# Altium project MB1184.PrjPCB
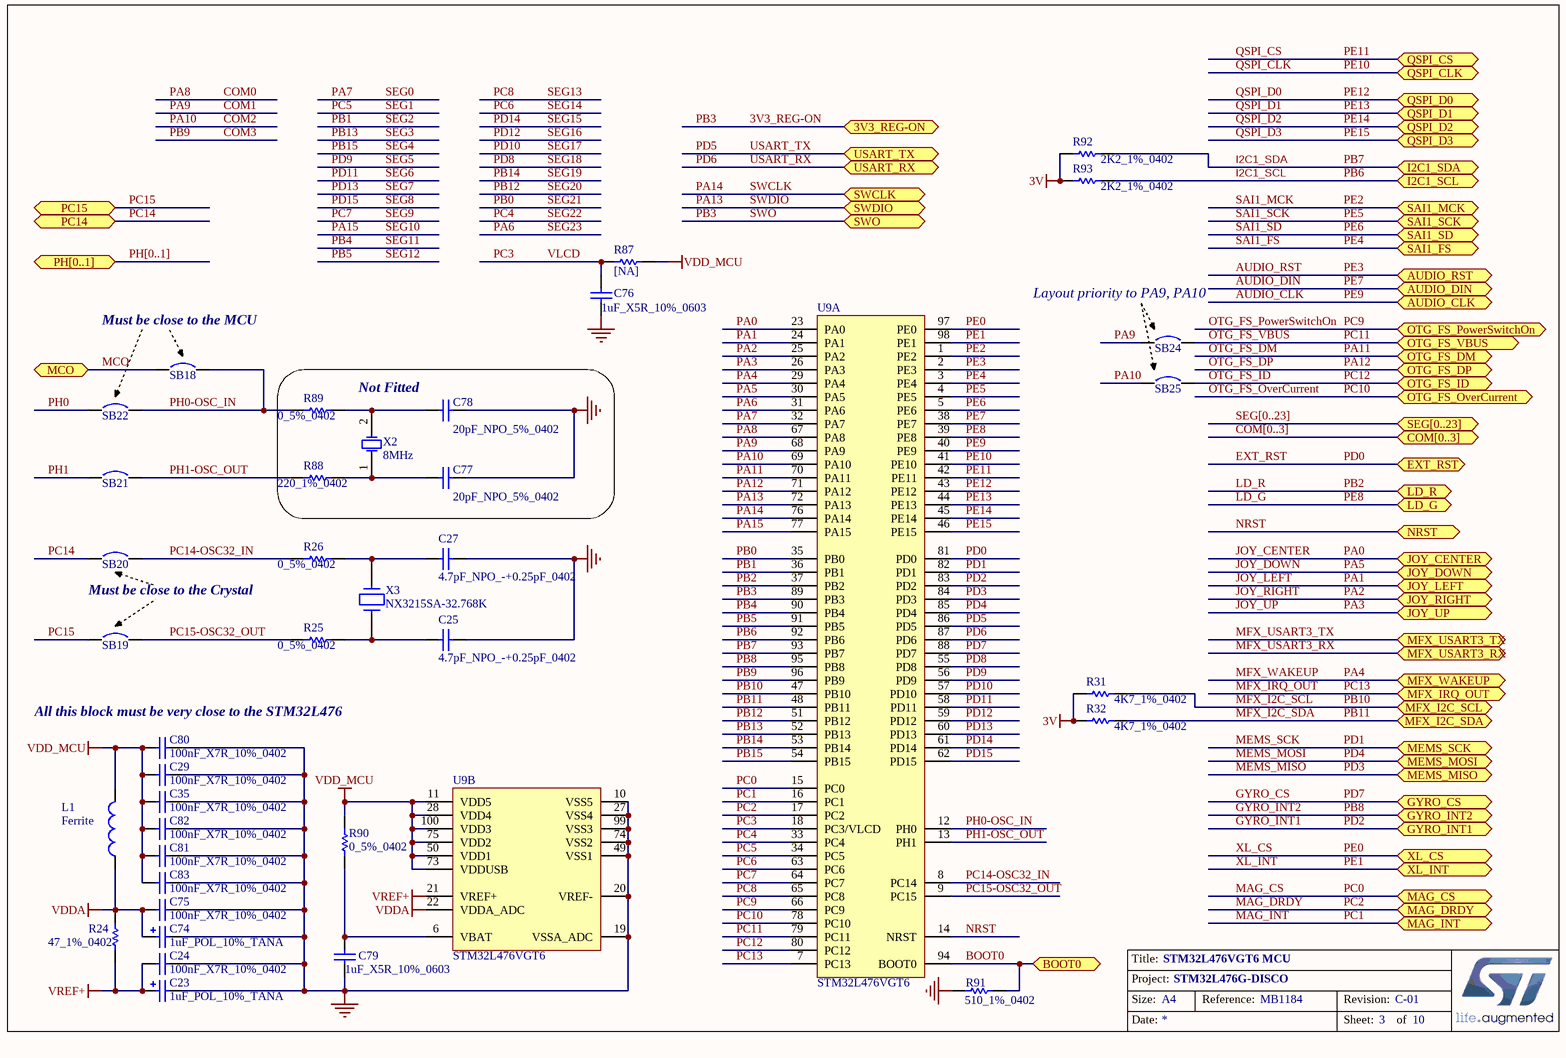
[diagram p0: STM32Lx.SchDoc]
5 sheets, 127 parts. Net scope: flat (ports and power ports of the same name join across sheets).
Sheets:
  STM32Lx.SchDoc
  IDD_measurement.SchDoc
  LCD_GH08172.SchDoc
  AUDIO.SchDoc
  MEMS.SchDoc

## Sheet STM32Lx.SchDoc: STM32L476VGT6 MCU
size A4; Date: 01-DEC-2013; Author: A.B; CompanyName: STMicroelectronics; Organization: Microcontrollers Division; Address1: 12, Rue Jules HOROWITZ; Address2: 38019 Grenoble; Address3: FRANCE; DocumentNumber: MB1184; Revision: C-01; SheetNumber: 3; SheetTotal: 10; Project: STM32L476G-DISCO

### Parts
C23  1uF_POL_10%_TANA  [TAN-A]
C24  100nF_X7R_10%_0402  [0402C]
C25  4.7pF_NPO_-+0.25pF_0402  [0402C]
C27  4.7pF_NPO_-+0.25pF_0402  [0402C]
C29  100nF_X7R_10%_0402  [0402C]
C35  100nF_X7R_10%_0402  [0402C]
C74  1uF_POL_10%_TANA  [TAN-A]
C75  100nF_X7R_10%_0402  [0402C]
C76  1uF_X5R_10%_0603  [0603C]
C77  20pF_NPO_5%_0402  [0402C]
C78  20pF_NPO_5%_0402  [0402C]
C79  1uF_X5R_10%_0603  [0603C]
C80  100nF_X7R_10%_0402  [0402C]
C81  100nF_X7R_10%_0402  [0402C]
C82  100nF_X7R_10%_0402  [0402C]
C83  100nF_X7R_10%_0402  [0402C]
L1  Ferrite  [0603L]
R24  47_1%_0402  [0402R]
R25  0_5%_0402  [0402R]
R26  0_5%_0402  [0402R]
R31  4K7_1%_0402  [0402R]
R32  4K7_1%_0402  [0402R]
R87  [NA]  [0402R]
R88  220_1%_0402  [0402R]
R89  0_5%_0402  [0402R]
R90  0_5%_0402  [0402R]
R91  510_1%_0402  [0402R]
R92  2K2_1%_0402  [0402R]
R93  2K2_1%_0402  [0402R]
SB18  Circuit Breaker  [JP2_SMD]  (value not drawn)
SB19  Circuit Breaker  [JP2_SMD]  (value not drawn)
SB20  Circuit Breaker  [JP2_SMD]  (value not drawn)
SB21  Circuit Breaker  [JP2_SMD]  (value not drawn)
SB22  Circuit Breaker  [JP2_SMD]  (value not drawn)
SB24  Circuit Breaker  [JP2_SMD]  (value not drawn)
SB25  Circuit Breaker  [JP2_SMD]  (value not drawn)
U9  STM32L476VGT6  [TQFP100_14x14]  (parts A,B of 2)
X2  8MHz  [XTAL1]
X3  NX3215SA-32.768K  [XTAL_2SM_3R2X1R5]

### Blocks framed on the sheet
Not Fitted: C77 C78 R88 R89 X2

### Ports
3V3_REG-ON, AUDIO_CLK, AUDIO_DIN, AUDIO_RST, BOOT0, COM[0..3], EXT_RST, GYRO_CS, GYRO_INT1, GYRO_INT2, I2C1_SCL, I2C1_SDA, JOY_CENTER, JOY_DOWN, JOY_LEFT, JOY_RIGHT, JOY_UP, LD_G, LD_R, MAG_CS, MAG_DRDY, MAG_INT, MCO, MEMS_MISO, MEMS_MOSI, MEMS_SCK, MFX_I2C_SCL, MFX_I2C_SDA, MFX_IRQ_OUT, MFX_USART3_RX, MFX_USART3_TX, MFX_WAKEUP, NRST, OTG_FS_DM, OTG_FS_DP, OTG_FS_ID, OTG_FS_OverCurrent, OTG_FS_PowerSwitchOn, OTG_FS_VBUS, PC14, PC15, PH[0..1], QSPI_CLK, QSPI_CS, QSPI_D0, QSPI_D1, QSPI_D2 (bidir), QSPI_D3, SAI1_FS, SAI1_MCK, SAI1_SCK, SAI1_SD, SEG[0..23], SWCLK, SWDIO, SWO, USART_RX, USART_TX, XL_CS, XL_INT

### Nets
3V: R31.1 R32.1 R92.1 R93.1
GND: C23.2 C24.2 C25.2 C27.2 C29.2 C35.2 C74.2 C75.2 C76.1 C77.2 C78.2 C79.1 C80.2 C81.2 C82.2 C83.2 R91.1 U9.10(VSS5) U9.19(VSSA_ADC) U9.20(VREF-) U9.27(VSS4) U9.49(VSS1) U9.74(VSS2) U9.99(VSS3)
VDD_MCU: C29.1 C35.1 C80.1 C81.1 C82.1 C83.1 L1.2 R87.2 R90.2 U9.11(VDD5) U9.28(VDD4) U9.50(VDD1) U9.73(VDDUSB) U9.75(VDD2) U9.100(VDD3)
VDDA: C74.1 C75.1 L1.1 R24.2 U9.22(VDDA_ADC)
VREF+: C23.1 C24.1 R24.1 U9.21(VREF+)
3V3_REG-ON: U9.89(PB3) ; port SWO, port 3V3_REG-ON  [also labelled PB3, SWO]
AUDIO_CLK: U9.40(PE9) ; port AUDIO_CLK  [also labelled PE9]
AUDIO_DIN: U9.38(PE7) ; port AUDIO_DIN  [also labelled PE7]
AUDIO_RST: U9.2(PE3) ; port AUDIO_RST  [also labelled PE3]
BOOT0: R91.2 U9.94(BOOT0) ; port BOOT0
COM0: U9.67(PA8)  [also labelled PA8]
COM1: SB24.1 U9.68(PA9)  [also labelled PA9]
COM2: SB25.1 U9.69(PA10)  [also labelled PA10]
COM3: U9.96(PB9)  [also labelled PB9]
EXT_RST: U9.81(PD0) ; port EXT_RST  [also labelled PD0]
GYRO_CS: U9.88(PD7) ; port GYRO_CS  [also labelled PD7]
GYRO_INT1: U9.83(PD2) ; port GYRO_INT1  [also labelled PD2]
GYRO_INT2: U9.95(PB8) ; port GYRO_INT2  [also labelled PB8]
I2C1_SCL: R93.2 U9.92(PB6) ; port I2C1_SCL  [also labelled PB6]
I2C1_SDA: R92.2 U9.93(PB7) ; port I2C1_SDA  [also labelled PB7]
JOY_CENTER: U9.23(PA0) ; port JOY_CENTER  [also labelled PA0]
JOY_DOWN: U9.30(PA5) ; port JOY_DOWN  [also labelled PA5]
JOY_LEFT: U9.24(PA1) ; port JOY_LEFT  [also labelled PA1]
JOY_RIGHT: U9.25(PA2) ; port JOY_RIGHT  [also labelled PA2]
JOY_UP: U9.26(PA3) ; port JOY_UP  [also labelled PA3]
LD_G: U9.39(PE8) ; port LD_G  [also labelled PE8]
LD_R: U9.37(PB2) ; port LD_R  [also labelled PB2]
MAG_CS: U9.15(PC0) ; port MAG_CS  [also labelled PC0]
MAG_DRDY: U9.17(PC2) ; port MAG_DRDY  [also labelled PC2]
MAG_INT: U9.16(PC1) ; port MAG_INT  [also labelled PC1]
MCO: SB18.1 ; port MCO
MEMS_MISO: U9.84(PD3) ; port MEMS_MISO  [also labelled PD3]
MEMS_MOSI: U9.85(PD4) ; port MEMS_MOSI  [also labelled PD4]
MEMS_SCK: U9.82(PD1) ; port MEMS_SCK  [also labelled PD1]
MFX_I2C_SCL: R31.2 U9.47(PB10) ; port MFX_I2C_SCL  [also labelled PB10]
MFX_I2C_SDA: R32.2 U9.48(PB11) ; port MFX_I2C_SDA  [also labelled PB11]
MFX_IRQ_OUT: U9.7(PC13) ; port MFX_IRQ_OUT  [also labelled PC13]
MFX_WAKEUP: U9.29(PA4) ; port MFX_WAKEUP  [also labelled PA4]
NRST: U9.14(NRST) ; port NRST
OTG_FS_DM: U9.70(PA11) ; port OTG_FS_DM  [also labelled PA11]
OTG_FS_DP: U9.71(PA12) ; port OTG_FS_DP  [also labelled PA12]
OTG_FS_ID: SB25.2 U9.80(PC12) ; port OTG_FS_ID  [also labelled PC12]
OTG_FS_OverCurrent: U9.78(PC10) ; port OTG_FS_OverCurrent  [also labelled PC10]
OTG_FS_PowerSwitchOn: U9.66(PC9) ; port OTG_FS_PowerSwitchOn  [also labelled PC9]
OTG_FS_VBUS: SB24.2 U9.79(PC11) ; port OTG_FS_VBUS  [also labelled PC11]
PA6: U9.31(PA6)  [also labelled SEG23]
PA7: U9.32(PA7)  [also labelled SEG0]
PA13: U9.72(PA13) ; port SWDIO  [also labelled SWDIO]
PA14: U9.76(PA14) ; port SWCLK  [also labelled SWCLK]
PA15: U9.77(PA15)  [also labelled SEG10]
PB0: U9.35(PB0)  [also labelled SEG21]
PB1: U9.36(PB1)  [also labelled SEG2]
PB4: U9.90(PB4)  [also labelled SEG11]
PB5: U9.91(PB5)  [also labelled SEG12]
PB12: U9.51(PB12)  [also labelled SEG20]
PB13: U9.52(PB13)  [also labelled SEG3]
PB14: U9.53(PB14)  [also labelled SEG19]
PB15: U9.54(PB15)  [also labelled SEG4]
PC3: C76.2 R87.1 U9.18(PC3/VLCD)  [also labelled VLCD]
PC4: U9.33(PC4)  [also labelled SEG22]
PC5: U9.34(PC5)  [also labelled SEG1]
PC6: U9.63(PC6)  [also labelled SEG14]
PC7: U9.64(PC7)  [also labelled SEG9]
PC8: U9.65(PC8)  [also labelled SEG13]
PC14: SB20.1 ; port PC14
PC14-OSC32_IN: R26.1 SB20.2 U9.8(PC14)
PC15: SB19.1 ; port PC15
PC15-OSC32_OUT: R25.1 SB19.2 U9.9(PC15)
PD5: U9.86(PD5) ; port USART_TX  [also labelled USART_TX]
PD6: U9.87(PD6) ; port USART_RX  [also labelled USART_RX]
PD8: U9.55(PD8)  [also labelled SEG18]
PD9: U9.56(PD9)  [also labelled SEG5]
PD10: U9.57(PD10)  [also labelled SEG17]
PD11: U9.58(PD11)  [also labelled SEG6]
PD12: U9.59(PD12)  [also labelled SEG16]
PD13: U9.60(PD13)  [also labelled SEG7]
PD14: U9.61(PD14)  [also labelled SEG15]
PD15: U9.62(PD15)  [also labelled SEG8]
PE0: U9.97(PE0) ; port XL_CS  [also labelled XL_CS]
PE1: U9.98(PE1) ; port XL_INT  [also labelled XL_INT]
PE2: U9.1(PE2) ; port SAI1_MCK  [also labelled SAI1_MCK]
PE4: U9.3(PE4) ; port SAI1_FS  [also labelled SAI1_FS]
PE5: U9.4(PE5) ; port SAI1_SCK  [also labelled SAI1_SCK]
PE6: U9.5(PE6) ; port SAI1_SD  [also labelled SAI1_SD]
PE10: U9.41(PE10) ; port QSPI_CLK  [also labelled QSPI_CLK]
PE11: U9.42(PE11) ; port QSPI_CS  [also labelled QSPI_CS]
PE12: U9.43(PE12) ; port QSPI_D0  [also labelled QSPI_D0]
PE13: U9.44(PE13) ; port QSPI_D1  [also labelled QSPI_D1]
PE14: U9.45(PE14) ; port QSPI_D2  [also labelled QSPI_D2]
PE15: U9.46(PE15) ; port QSPI_D3  [also labelled QSPI_D3]
PH0: SB22.1
PH0-OSC_IN: R89.1 SB18.2 SB22.2 U9.12(PH0)
PH1: SB21.1
PH1-OSC_OUT: R88.1 SB21.2 U9.13(PH1)
NetC25_1: C25.1 R25.2 X3.2
NetC27_1: C27.1 R26.2 X3.1
NetC77_1: C77.1 R88.2 X2.1(OSC1)
NetC78_1: C78.1 R89.2 X2.2(OSC2)
NetC79_2: C79.2 R90.1 U9.6(VBAT)

### Buses and harness runs
bus COM[0..3] = port COM[0..3]
bus PH[0..1] = port PH[0..1]
bus SEG[0..23] = port SEG[0..23]

### Notes on the sheet
- (near SB24) Layout priority to PA9, PA10
- (near SB18) Must be close to the MCU
- Must be close to the Crystal
- (near C80) All this block must be very close to the STM32L476
- Title:
- Project:
- Size:
- Date:
- A4
- Reference:
- Sheet:
- Revision:
- of

### Library data of the parts
C23 C74 = Cap_1uF_POL_10%_TANA: Polarized Capacitor,1uF,16V,10%,typeA,AVX; Manuf_Part_1: TAJA105K016R; Revision: July-2002: Re-released for DXP Platform.; Value: 1uF; Manuf_1: AVX; Distrib: *; Order: TAJA105K016R; ECCN_US/EU: n/a
C24 C29 C35 C75 C80-C83 = Cap_100nF_X7R_10%_0402: Capacitor,100nF,16V,X7R,10%,0402,YAGEO; Manuf_Part_1: CC0402KRX7R7BB104; Revision: July-2002: Re-released for DXP Platform.; Value: 100nF; Order: CC0402KRX7R7BB104; Manuf_1: YAGEO; ECCN_US/EU: n/a
C25 C27 = Cap_4.7pF_NPO_-+0.25pF_0402: Capacitor, 4.7pF, 50V, NPO, -+0.25pF, 0402, YAGEO; Manuf_Part_1: CC0402CRNPO9BN4R7; Order: 311-1367-2-ND; Revision: July-2002: Re-released for DXP Platform.; Value: 4.7pF; Manuf_1: YAGEO; ECCN_US/EU: n/a; Distrib: DIGIKEY
C76 C79 = Cap_1uF_X5R_10%_0603: Capacitor,1uF,16V,X5R,10%,0603,YAGEO; Manuf_Part_1: CC0603KRX5R7BB105; Revision: July-2002: Re-released for DXP Platform.; Value: 1uF; Order: CC0603KRX5R7BB105; Manuf_1: YAGEO; ECCN_US/EU: n/a
C77 C78 = Cap_20pF_NPO_5%_0402: Capacitor,20pF,50V,NPO,5%,0402,YAGEO; Order: CC0402JRNPO9BN200; Fitted: NO; Revision: July-2002: Re-released for DXP Platform.; Value: 20pF; Manuf_1: YAGEO; Manuf_Part_1: CC0402JRNPO9BN200; ECCN_US/EU: n/a
L1 = BEAD_600R_350MA_0603: Bead,600R,350mA,0603,FCM1608KF-601T03,Tai-tech; Manuf_2: TDK; Manuf_Part_2: MPZ1608S300A; Value: 100uH; Comment_1: bead,30R,5A,0603,MPZ1608S300A,TDK; Revision: July-2002: Re-released for DXP Platform.; Manuf_Part_1: FCM1608KF-601T03; Order: FCM1608KF-601T03; Manuf_1: Tai-tech; ECCN_US/EU: n/a
R24 = Res_47_1%_0402: Resistor,47,0402,1%,YAGEO; Manuf_Part_1: RC0402FR-0747RL; Value: 47; Order: 311-47.0LRCT-ND; Manuf_1: YAGEO; ECCN_US/EU: n/a; Distrib: DIGIKEY
R25 R26 R90 = Res_0_5%_0402: Resistor,0,0402,5%,YAGEO; Manuf_Part_1: RC0402JR-070RL; Value: 0; Order: 2363467; ECCN_US/EU: n/a; Manuf_1: YAGEO; Distrib: FARNELL
R31 R32 = Res_4K7_1%_0402: Resistor,4K7,0402,1%,YAGEO; Manuf_Part_1: RT0402FRE074K7L; Value: 4K7; Manuf_1: YAGEO; Order: RT0402FRE074K7L; ECCN_US/EU: n/a
R87 = Res_NA_0402: Resistor,[NA],0402; Fitted: NO; Value: [NA]; ECCN_US/EU: n/a
R88 = Res_220_1%_0402: Resistor,220,0402,1%,YAGEO; Manuf_Part_1: RC0402FR-07220RL; Value: 220; Fitted: NO; Manuf_1: YAGEO; Order: RC0402FR-07220RL; ECCN_US/EU: n/a; Distrib: DIGIKEY
R89 = Res_0_5%_0402: Resistor,0,0402,5%,YAGEO; Manuf_Part_1: RC0402JR-070RL; Value: 0; Order: 2363467; Fitted: NO; ECCN_US/EU: n/a; Manuf_1: YAGEO; Distrib: FARNELL
R91 = Res_510_1%_0402: Resistor,510,0402,1%,YAGEO; Manuf_Part_1: RC0402FR-07510L; Value: 510; Manuf_1: YAGEO; Order: RC0402FR-07510L; ECCN_US/EU: n/a; Distrib: DIGIKEY
R92 R93 = Res_2K2_1%_0402: Resistor,2K2,0402,1%,YAGEO; Manuf_Part_1: RC0402FR-072R2L; Value: 2K2; Manuf_1: YAGEO; Order: RC0402FR-072R2L; ECCN_US/EU: n/a
SB18-SB20 SB24 SB25 = Circuit Breaker: Solder: NO; Published: 24-Mar-1999; Revision: July-2002: Re-released for DXP Platform.; Publisher: Altium Limited
SB21 SB22 = Circuit Breaker: Solder: YES; Published: 24-Mar-1999; Revision: July-2002: Re-released for DXP Platform.; Publisher: Altium Limited
U9 = STM32L476VGT6: STM32 Orca (STM32L476VGT6); Manuf_Part_1: STM32L476VGT6U; Manuf_1: STM; Provided: ST; Ref St: xxxxxxxxx; ECCN_US/EU: 3A991A2/NEC; Distrib: ST; Footprint: QFP100
X2 = XTAL: Crystal Oscillator,8Mhz,20PF,20PPM,-10-70 degree,DIP,HC-49S; Manuf_Part_1: 9SL8000020AFXHF0; ECCN_US/EU: EAR99/NEC; Fitted: NO; Order: 9SL8000020AFXHF0
X3 = XTAL_32K_NX3215SA: Crystal 32.768kHz, 6pF, -+20PPM, R=50K, SMD; Manuf_1: NDK; Manuf_Part_1: NX3215SA 32.768KHz EXS00A-MU00525; ECCN_US/EU: EAR99/NEC; Ref St: 9157034; NDK Ref: X3101802; Provided: ST; Distrib: *; Order: NX3215SA 32.768KHz EXS00A-MU00525

## Sheet IDD_measurement.SchDoc: IDD measurement / MFX (Multi Function eXpander)
size A4; Date: 01-DEC-2013; Author: A.B; CompanyName: STMicroelectronics; Organization: Microcontrollers Division; Address1: 12, Rue Jules HOROWITZ; Address2: 38019 Grenoble; Address3: FRANCE; DocumentNumber: MB1184; Revision: C-01; SheetNumber: 4; SheetTotal: 10; Project: STM32L476G-DISCO
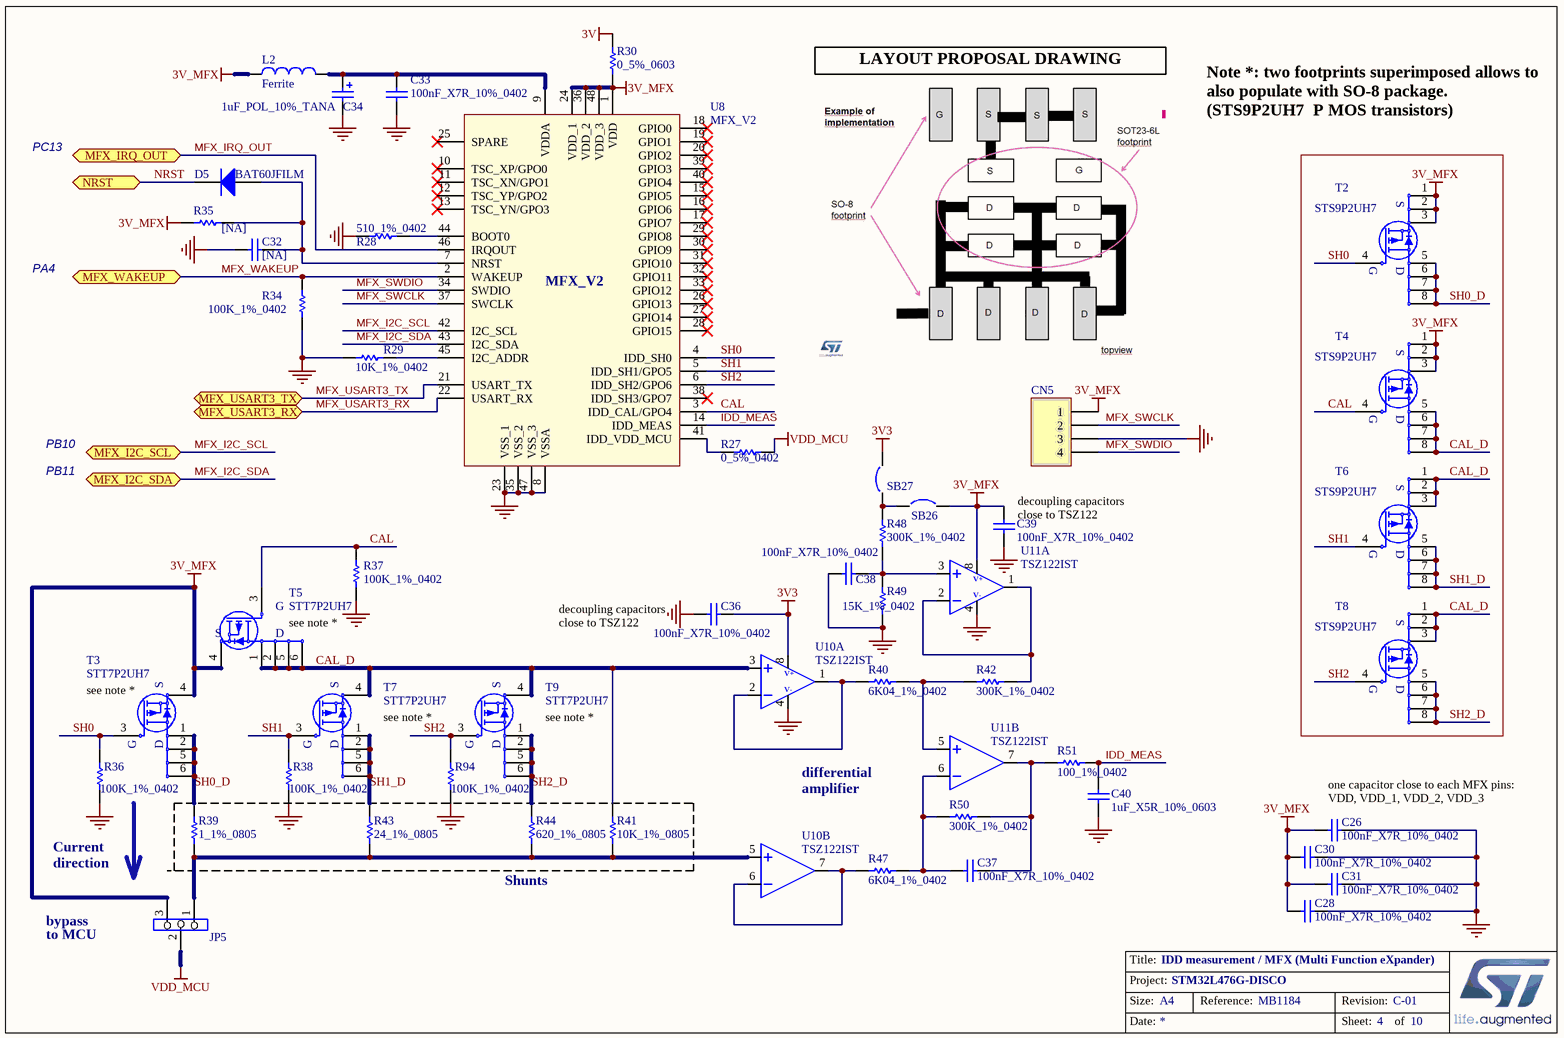
[diagram p1: IDD_measurement.SchDoc]

### Parts
C26  100nF_X7R_10%_0402  [0402C]
C28  100nF_X7R_10%_0402  [0402C]
C30  100nF_X7R_10%_0402  [0402C]
C31  100nF_X7R_10%_0402  [0402C]
C32  [NA]  [0402C]
C33  100nF_X7R_10%_0402  [0402C]
C34  1uF_POL_10%_TANA  [TAN-A]
C36  100nF_X7R_10%_0402  [0402C]
C37  100nF_X7R_10%_0402  [0402C]
C38  100nF_X7R_10%_0402  [0402C]
C39  100nF_X7R_10%_0402  [0402C]
C40  1uF_X5R_10%_0603  [0603C]
CN5  Header 4  [Header 4]  (value not drawn)
D5  BAT60JFILM  [SOD323/A]
JP5  Jumper 3 pins  [SIP3]  (value not drawn)
L2  Ferrite  [0603L]
R27  0_5%_0402  [0402R]
R28  510_1%_0402  [0402R]
R29  10K_1%_0402  [0402R]
R30  0_5%_0603  [0603R-GS]
R34  100K_1%_0402  [0402R]
R35  [NA]  [0402R]
R36  100K_1%_0402  [0402R]
R37  100K_1%_0402  [0402R]
R38  100K_1%_0402  [0402R]
R39  1_1%_0805  [0805R]
R40  6K04_1%_0402  [0402R]
R41  10K_1%_0805  [0805R]
R42  300K_1%_0402  [0402R]
R43  24_1%_0805  [0805R]
R44  620_1%_0805  [0805R]
R47  6K04_1%_0402  [0402R]
R48  300K_1%_0402  [0402R]
R49  15K_1%_0402  [0402R]
R50  300K_1%_0402  [0402R]
R51  100_1%_0402  [0402R]
R94  100K_1%_0402  [0402R]
SB26  Circuit Breaker  [JP2_SMD]  (value not drawn)
SB27  Circuit Breaker  [JP2_SMD]  (value not drawn)
T2  STS9P2UH7  [SO8]
T3  STT7P2UH7  [SOT23-6L]
T4  STS9P2UH7  [SO8]
T5  STT7P2UH7  [SOT23-6L]
T6  STS9P2UH7  [SO8]
T7  STT7P2UH7  [SOT23-6L]
T8  STS9P2UH7  [SO8]
T9  STT7P2UH7  [SOT23-6L]
U8  MFX_V2  [QFP48 7X7]
U10  TSZ122IST  [miniSO8]  (parts A,B of 2)
U11  TSZ122IST  [miniSO8]  (parts A,B of 2)

### Ports
MFX_I2C_SCL, MFX_I2C_SDA, MFX_IRQ_OUT, MFX_USART3_RX, MFX_USART3_TX, MFX_WAKEUP, NRST

### Nets
3V: R30.2
3V3: C36.2 SB27.2 U10.8
3V_MFX: C26.1 C28.1 C30.1 C31.1 C39.2 CN5.1 JP5.3 L2.1 R30.1 R35.1 SB26.2 T2.1(S) T2.2(S) T2.3(S) T3.4(S) T4.1(S) T4.2(S) T4.3(S) T5.4(S) U8.1(VDD) U8.24(VDD_1) U8.36(VDD_2) U8.48(VDD_3) U11.8
GND: C26.2 C28.2 C30.2 C31.2 C32.1 C33.1 C34.2 C36.1 C38.1 C39.1 C40.1 CN5.3 R28.1 R29.1 R34.1 R36.1 R37.1 R38.1 R49.1 R94.1 U8.8(VSSA) U8.23(VSS_1) U8.35(VSS_2) U8.47(VSS_3) U10.4 U11.4
VDD_MCU: JP5.2 R27.2
CAL: R37.2 T4.4(G) T5.3(G) U8.3(IDD_CAL/GPO4)
CAL_D: R41.2 T4.5(D) T4.6(D) T4.7(D) T4.8(D) T5.1(S) T5.2(S) T5.5(D) T5.6(D) T6.1(S) T6.2(S) T6.3(S) T7.4(S) T8.1(S) T8.2(S) T8.3(S) T9.4(S) U10.3
IDD_MEAS: C40.2 R51.2 U8.14(IDD_MEAS)
MFX_I2C_SCL: U8.42(I2C_SCL) ; port MFX_I2C_SCL
MFX_I2C_SDA: U8.43(I2C_SDA) ; port MFX_I2C_SDA
MFX_IRQ_OUT: U8.46(IRQOUT) ; port MFX_IRQ_OUT
MFX_SWCLK: CN5.2 U8.37(SWCLK)
MFX_SWDIO: CN5.4 U8.34(SWDIO)
MFX_USART3_RX: U8.22(USART_RX) ; port MFX_USART3_RX
MFX_USART3_TX: U8.21(USART_TX) ; port MFX_USART3_TX
MFX_WAKEUP: R34.2 U8.2(WAKEUP) ; port MFX_WAKEUP
NRST: D5.2(K) ; port NRST
SH0: R36.2 T2.4(G) T3.3(G) U8.4(IDD_SH0)
SH0_D: R39.2 T2.5(D) T2.6(D) T2.7(D) T2.8(D) T3.1(S) T3.2(S) T3.5(D) T3.6(D)
SH1: R38.2 T6.4(G) T7.3(G) U8.5(IDD_SH1/GPO5)
SH1_D: R43.2 T6.5(D) T6.6(D) T6.7(D) T6.8(D) T7.1(S) T7.2(S) T7.5(D) T7.6(D)
SH2: R94.2 T8.4(G) T9.3(G) U8.6(IDD_SH2/GPO6)
SH2_D: R44.2 T8.5(D) T8.6(D) T8.7(D) T8.8(D) T9.1(S) T9.2(S) T9.5(D) T9.6(D)
NetC32_2: C32.2 D5.1(A) R35.2 U8.7(NRST)
NetC33_2: C33.2 C34.1 L2.2 U8.9(VDDA)
NetC37_1: C37.1 R47.2 R50.1 U11.6
NetC37_2: C37.2 R50.2 R51.1 U11.7
NetC38_2: C38.2 R48.1 R49.2 U11.3
NetJP5_1: JP5.1 R39.1 R41.1 R43.1 R44.1 U10.5
NetR27_1: R27.1 U8.41(IDD_VDD_MCU)
NetR28_2: R28.2 U8.44(BOOT0)
NetR29_2: R29.2 U8.45(I2C_ADDR)
NetR40_1: R40.1 U10.1 U10.2
NetR40_2: R40.2 R42.1 U11.5
NetR42_2: R42.2 U11.1 U11.2
NetR47_1: R47.1 U10.6 U10.7
NetR48_2: R48.2 SB26.1 SB27.1

Not connected (* = marked no-connect by the designer): U8 10(TSC_XP/GPO0)* 11(TSC_XN/GPO1)* 12(TSC_YP/GPO2)* 13(TSC_YN/GPO3)* 15(GPIO5)* 16(GPIO6)* 17(GPIO7)* 18(GPIO0)* 19(GPIO1)* 20(GPIO2)* 25(SPARE)* 26(GPIO13)* 27(GPIO14)* 28(GPIO15)* 29(GPIO8)* 30(GPIO9)* 31(GPIO10)* 32(GPIO11)* 33(GPIO12)* 38(IDD_SH3/GPO7)* 39(GPIO3)* 40(GPIO4)*

### Notes on the sheet
- LAYOUT PROPOSAL DRAWING
- PC13
- Note *: two footprints superimposed allows to also populate with SO-8 package.
  (STS9P2UH7  P MOS transistors)
- PA4
- PB10
- PB11
- (near C39) decoupling capacitors
  close to TSZ122
- (near T5) see note *
- (near C36) decoupling capacitors
  close to TSZ122
- (near T3) see note *
- see note *
- (near T9) see note *
- differential
  amplifier
- (near C26) one capacitor close to each MFX pins: VDD, VDD_1, VDD_2, VDD_3
- Current direction
- Shunts
- to MCU
- bypass
- Title:
- Project:
- Size:
- Date:
- A4
- Reference:
- Sheet:
- Revision:
- of
- (in symbol TSZ122IST, part A) V+; V-

### Library data of the parts
C26 C28 C30 C31 C33 C36-C39 = Cap_100nF_X7R_10%_0402: as C24 on sheet STM32Lx; Revision: July-2002: Re-released for DXP Platform.; Value: 100nF; Order: CC0402KRX7R7BB104; Manuf_1: YAGEO; ECCN_US/EU: n/a
C32 = Cap_NA_0402: Capacitor,NA,0402; Fitted: NO; Revision: July-2002: Re-released for DXP Platform.; Value: [NA]; ECCN_US/EU: n/a
C34 = Cap_1uF_POL_10%_TANA: as C23 on sheet STM32Lx; Revision: July-2002: Re-released for DXP Platform.; Value: 1uF; Manuf_1: AVX; Distrib: *; Order: TAJA105K016R; ECCN_US/EU: n/a
C40 = Cap_1uF_X5R_10%_0603: as C76 on sheet STM32Lx; Revision: July-2002: Re-released for DXP Platform.; Value: 1uF; Order: CC0603KRX5R7BB105; Manuf_1: YAGEO; ECCN_US/EU: n/a
CN5 = Header 4: Header, 4-Pin; Fitted: NO; Revision: 17-Jul-2002: Re-released for DXP Platform.; Publisher: Altium Limited; ECCN_US/EU: n/a
D5 = BAT60JFILM: Manuf_1: STM; Provided: ST; ECCN_US/EU: EAR99/NEC; Ref St: 9151097; Revision: July-2002: Re-released for DXP Platform.; Order: BAT60JFILM; Manuf_Part_1: BAT60JFILM; Distrib: ST
JP5 = Jumper3: ECCN_US/EU: n/a
L2 = BEAD_600R_350MA_0603: Bead,600R,350mA,0603,FCM1608KF-601T03,Tai-tech; Manuf_2: TDK; Manuf_Part_2: MPZ1608S300A; Value: 100uH; Comment_1: bead,30R,5A,0603,MPZ1608S300A,TDK; Ordered by: Subcon; Revision: July-2002: Re-released for DXP Platform.; Manuf_Part_1: FCM1608KF-601T03; Order: FCM1608KF-601T03; Manuf_1: Tai-tech
R27 = Res_0_5%_0402: as R25 on sheet STM32Lx; ECCN_US/EU: n/a; Manuf_1: YAGEO; Distrib: FARNELL
R28 = Res_510_1%_0402: as R91 on sheet STM32Lx; Manuf_1: YAGEO; Order: RC0402FR-07510L; ECCN_US/EU: n/a; Distrib: DIGIKEY
R29 = Res_10K_1%_0402: Resistor,10K,0402,1%,YAGEO; Manuf_Part_1: RC0402FR-0710KL; Value: 10K; Manuf_1: YAGEO; Order: RC0402FR-0710KL; ECCN_US/EU: n/a
R30 = Res_0_5%_0603: Resistor,0,0603,5%,YAGEO; Manuf_Part_1: RC0603JR-070RL; Value: 0; Order: 2363481; ECCN_US/EU: n/a; Manuf_1: YAGEO; Distrib: FARNELL
R34 R36-R38 R94 = Res_100K_1%_0402: Resistor,100K,0402,1%,YAGEO; Manuf_Part_1: RT0402FRE07100KL; Value: 100K; Manuf_1: YAGEO; Order: RT0402FRE07100KL; ECCN_US/EU: n/a
R35 = Res_NA_0402: Resistor,[NA],0402; Fitted: NO; Value: [NA]; ECCN_US/EU: n/a
R39 = Res_1_1%_0805: Resistor,1,0805,1%,YAGEO; Manuf_Part_1: RC0805FR-071RL; Value: 1; Manuf_1: YAGEO; Order: RC0805FR-071RL; ECCN_US/EU: n/a
R40 R47 = Res_6K04_1%_0402: Resistor,6K04,0402,1%,YAGEO; Manuf_Part_1: RC0402FR-076K04L; Value: 6K04; Manuf_1: YAGEO; Order: RC0402FR-076K04L; ECCN_US/EU: n/a
R41 = Res_10K_1%_0805: Resistor,10K,0805,1%,YAGEO; Manuf_Part_1: RC0805FR-0710KL; Value: 10K; Manuf_1: YAGEO; Order: RC0805FR-0710KL; ECCN_US/EU: n/a
R42 R48 R50 = Res_300K_1%_0402: Resistor,300K,0402,1%,YAGEO; Manuf_Part_1: RC0402FR-07300KL; Value: 300K; Manuf_1: YAGEO; Order: RC0402FR-07300KL; ECCN_US/EU: n/a
R43 = Res_24_1%_0805: Resistor,24,0805,1%,YAGEO; Manuf_Part_1: RC0805FR-0724RL; Value: 24; Manuf_1: YAGEO; Order: RC0805FR-0724RL; ECCN_US/EU: n/a
R44 = Res_620_1%_0805: Resistor,620,0805,1%,YAGEO; Manuf_Part_1: RC0805FR-07620RL; Value: 620; Manuf_1: YAGEO; Order: RC0805FR-07620RL; ECCN_US/EU: n/a
R49 = Res_15K_1%_0402: Resistor,15K,0402,1%,YAGEO; Manuf_Part_1: RC0402FR-0715KL; Value: 15K; Manuf_1: YAGEO; Order: RC0402FR-0715KL; ECCN_US/EU: n/a
R51 = Res_100_1%_0402: Resistor,100,0402,1%,YAGEO; Manuf_Part_1: RC0402FR-07100RL; Value: 100; Order: 9239111; Manuf_1: YAGEO; ECCN_US/EU: n/a; Distrib: FARNELL
SB26 = Circuit Breaker: Solder: YES; Revision: July-2002: Re-released for DXP Platform.
SB27 = Circuit Breaker: Solder: NO; Revision: July-2002: Re-released for DXP Platform.
T2 = STS7P2UH7: STripFET VII Power MOSFET, P-CHANNEL 20V - 0.023 - 7A - SO-8; Manuf_1: STM; Provided: ST; Ref St: xxxxxxxx; ECCN_US/EU: EAR99/NEC; Fitted: NO; Comments: exclusive with T9; Manuf_Part_1: STS9P2UH7; Order: STS9P2UH7; Distrib: ST; Ordered by: STM
T3 = STT7P2UH7: STripFET VII DeepGATE Power MOSFET, P-CHANNEL 20 V, 0.0146, 7 A - SOT23-6L; Manuf_1: STM; Provided: ST; Ref St: xxxxxxxx; ECCN_US/EU: EAR99/NEC; Comments: exclusive with T8; Manuf_Part_1: STT7P2UH7; Order: STT7P2UH7; Distrib: ST; Ordered by: STM
T4 = STS7P2UH7: STripFET VII Power MOSFET, P-CHANNEL 20V - 0.023 - 7A - SO-8; Manuf_1: STM; Provided: ST; Ref St: xxxxxxxx; ECCN_US/EU: EAR99/NEC; Fitted: NO; Comments: exclusive with T5; Manuf_Part_1: STS9P2UH7; Order: STS9P2UH7; Distrib: ST; Ordered by: STM
T5 = STT7P2UH7: STripFET VII DeepGATE Power MOSFET, P-CHANNEL 20 V, 0.0146, 7 A - SOT23-6L; Manuf_1: STM; Provided: ST; Ref St: xxxxxxxx; ECCN_US/EU: EAR99/NEC; Comments: exclusive with T2; Manuf_Part_1: STT7P2UH7; Order: STT7P2UH7; Distrib: ST; Ordered by: STM
T6 = STS7P2UH7: STripFET VII Power MOSFET, P-CHANNEL 20V - 0.023 - 7A - SO-8; Manuf_1: STM; Provided: ST; Ref St: xxxxxxxx; ECCN_US/EU: EAR99/NEC; Fitted: NO; Comments: exclusive with T6; Manuf_Part_1: STS9P2UH7; Order: STS9P2UH7; Distrib: ST; Ordered by: STM
T7 = STT7P2UH7: STripFET VII DeepGATE Power MOSFET, P-CHANNEL 20 V, 0.0146, 7 A - SOT23-6L; Manuf_1: STM; Provided: ST; Ref St: xxxxxxxx; ECCN_US/EU: EAR99/NEC; Comments: exclusive with T3; Manuf_Part_1: STT7P2UH7; Order: STT7P2UH7; Distrib: ST; Ordered by: STM
T8 = STS7P2UH7: STripFET VII Power MOSFET, P-CHANNEL 20V - 0.023 - 7A - SO-8; Manuf_1: STM; Provided: ST; Ref St: xxxxxxxx; ECCN_US/EU: EAR99/NEC; Fitted: NO; Comments: exclusive with T7; Manuf_Part_1: STS9P2UH7; Order: STS9P2UH7; Distrib: ST; Ordered by: STM
T9 = STT7P2UH7: STripFET VII DeepGATE Power MOSFET, P-CHANNEL 20 V, 0.0146, 7 A - SOT23-6L; Manuf_1: STM; Provided: ST; Ref St: xxxxxxxx; ECCN_US/EU: EAR99/NEC; Comments: exclusive with T4; Manuf_Part_1: STT7P2UH7; Order: STT7P2UH7; Distrib: ST; Ordered by: STM
U8 = MFX_V2: MultiFunction eXpander (STM32L152CCT6); Manuf_1: STM; ECCN_US/EU: 3A991A2/NEC; Provided: ST; Order: STM32L152CCT6; Distrib: ST; Manuf_Part_1: STM32L152CCT6
U10 U11 = TSZ122IST: Very high accuracy (5 µV) zero drift 5 V dual OpAmp; Manuf_1: STM; ECCN_US/EU: EAR99/NEC; Provided: ST; Ref St: xxxxxxxxx; Manuf_Part_1: TSZ122IST; Distrib: ST; Order: TSZ122IST

## Sheet LCD_GH08172.SchDoc: LCD Display
size A4; Date: 01-DEC-2013; Author: A.B; CompanyName: STMicroelectronics; Organization: Microcontrollers Division; Address1: 12, Rue Jules HOROWITZ; Address2: 38019 Grenoble; Address3: FRANCE; DocumentNumber: MB1184; Revision: C-01; SheetNumber: 6; SheetTotal: 10; Project: STM32L476G-DISCO
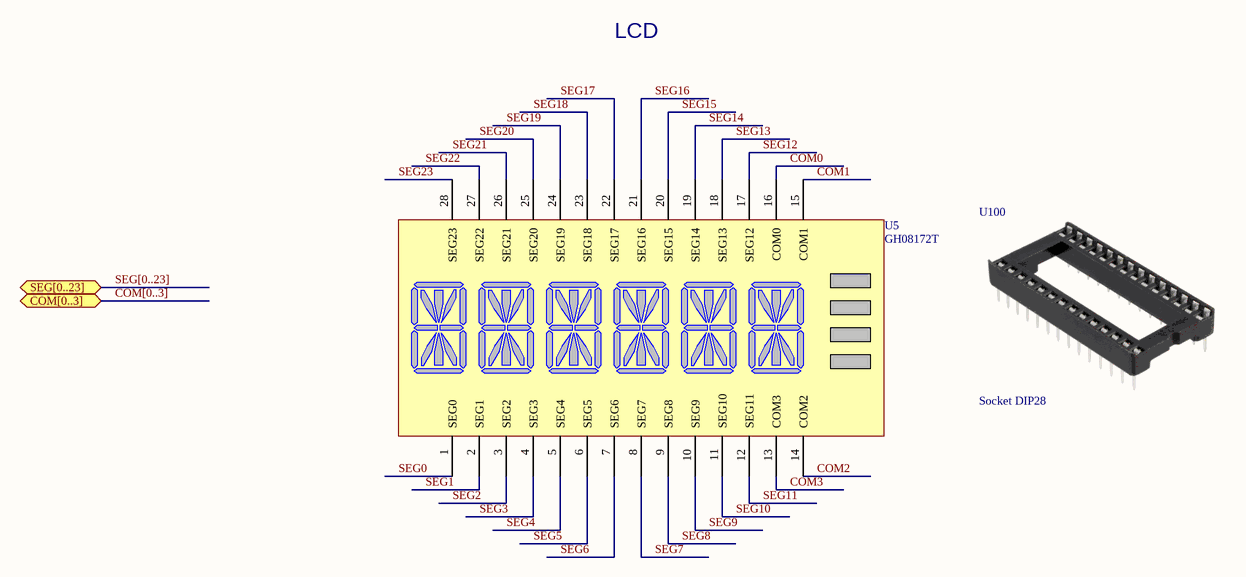
[diagram p2: LCD_GH08172.SchDoc]

### Parts
U5  GH08172T  [DIP28]
U100  Socket DIP28  [DIP28]

### Ports
COM[0..3], SEG[0..23]

### Nets
COM0: U5.16(COM0)
COM1: U5.15(COM1)
COM2: U5.14(COM2)
COM3: U5.13(COM3)
SEG0: U5.1(SEG0)  [project net PA7]
SEG1: U5.2(SEG1)  [project net PC5]
SEG2: U5.3(SEG2)  [project net PB1]
SEG3: U5.4(SEG3)  [project net PB13]
SEG4: U5.5(SEG4)  [project net PB15]
SEG5: U5.6(SEG5)  [project net PD9]
SEG6: U5.7(SEG6)  [project net PD11]
SEG7: U5.8(SEG7)  [project net PD13]
SEG8: U5.9(SEG8)  [project net PD15]
SEG9: U5.10(SEG9)  [project net PC7]
SEG10: U5.11(SEG10)  [project net PA15]
SEG11: U5.12(SEG11)  [project net PB4]
SEG12: U5.17(SEG12)  [project net PB5]
SEG13: U5.18(SEG13)  [project net PC8]
SEG14: U5.19(SEG14)  [project net PC6]
SEG15: U5.20(SEG15)  [project net PD14]
SEG16: U5.21(SEG16)  [project net PD12]
SEG17: U5.22(SEG17)  [project net PD10]
SEG18: U5.23(SEG18)  [project net PD8]
SEG19: U5.24(SEG19)  [project net PB14]
SEG20: U5.25(SEG20)  [project net PB12]
SEG21: U5.26(SEG21)  [project net PB0]
SEG22: U5.27(SEG22)  [project net PC4]
SEG23: U5.28(SEG23)  [project net PA6]

### Buses and harness runs
bus COM[0..3] = port COM[0..3]
bus SEG[0..23] = port SEG[0..23]

### Notes on the sheet
- LCD
- Title:
- Project:
- Size:
- Date:
- A4
- Reference:
- Sheet:
- Revision:
- of

### Library data of the parts
U5 = GH08172T: LCD 6x16 segments, 4 Common, Multiplexed 1/4 Duty, 1/3 Bias, 3V, DIP28; Manuf_1: hzdslcd; Order: GH08172T-B; ECCN_US/EU: EAR99/NEC; Manuf_Part_1: GH08172T-B; Distrib: JIUBABA
U100 = GH08172T_Socket: Socket DIP28 for GH08172T LCD; Manuf_Part_1: ED28DT; Manuf_1: On Shore Technology Inc; Order: ED3052-5-ND; Distrib: DIGIKEY; ECCN_US/EU: n/a

## Sheet AUDIO.SchDoc: Audio Codec and Microphone MEMS
size A4; Date: 01-DEC-2013; Author: A.B; CompanyName: STMicroelectronics; Organization: Microcontrollers Division; Address1: 12, Rue Jules HOROWITZ; Address2: 38019 Grenoble; Address3: FRANCE; DocumentNumber: MB1184; Revision: C-01; SheetNumber: 8; SheetTotal: 10; Project: STM32L476G-DISCO
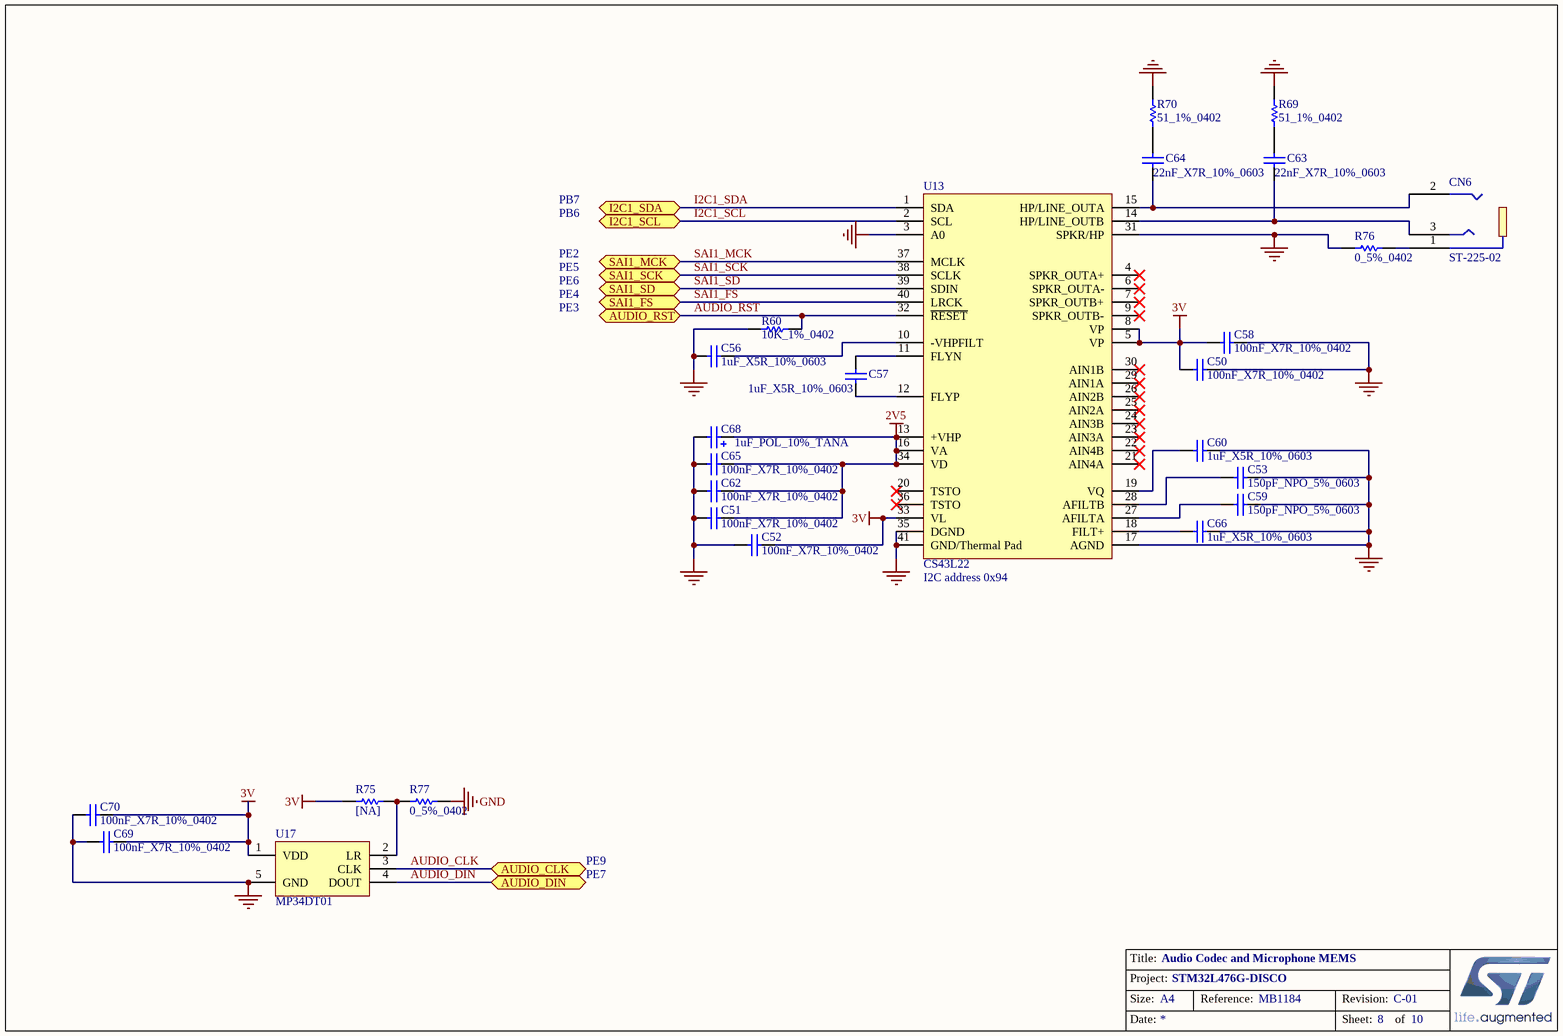
[diagram p3: AUDIO.SchDoc]

### Parts
C50  100nF_X7R_10%_0402  [0402C]
C51  100nF_X7R_10%_0402  [0402C]
C52  100nF_X7R_10%_0402  [0402C]
C53  150pF_NPO_5%_0603  [0603C]
C56  1uF_X5R_10%_0603  [0603C]
C57  1uF_X5R_10%_0603  [0603C]
C58  100nF_X7R_10%_0402  [0402C]
C59  150pF_NPO_5%_0603  [0603C]
C60  1uF_X5R_10%_0603  [0603C]
C62  100nF_X7R_10%_0402  [0402C]
C63  22nF_X7R_10%_0603  [0603C]
C64  22nF_X7R_10%_0603  [0603C]
C65  100nF_X7R_10%_0402  [0402C]
C66  1uF_X5R_10%_0603  [0603C]
C68  1uF_POL_10%_TANA  [TAN-A]
C69  100nF_X7R_10%_0402  [0402C]
C70  100nF_X7R_10%_0402  [0402C]
CN6  ST-225-02  [Jack-ST-225]
R60  10K_1%_0402  [0402R]
R69  51_1%_0402  [0402R]
R70  51_1%_0402  [0402R]
R75  [NA]  [0402R]
R76  0_5%_0402  [0402R]
R77  0_5%_0402  [0402R]
U13  CS43L22  [QFN40_6x6]
U17  MP34DT01  [HCLGA4_3X4]

### Ports
AUDIO_CLK, AUDIO_DIN, AUDIO_RST, I2C1_SCL, I2C1_SDA, SAI1_FS, SAI1_MCK, SAI1_SCK, SAI1_SD

### Nets
2V5: C51.2 C62.2 C65.2 C68.1 U13.13(+VHP) U13.16(VA) U13.34(VD)
3V: C50.1 C52.2 C58.1 C69.2 C70.2 R75.2 U13.5(VP) U13.8(VP) U13.33(VL) U17.1(VDD)
GND: C50.2 C51.1 C52.1 C53.2 C56.1 C58.2 C59.2 C60.2 C62.1 C65.1 C66.2 C68.2 C69.1 C70.1 R60.1 R69.2 R70.2 R76.1 R77.1 U13.3(A0) U13.17(AGND) U13.31(SPKR/HP) U13.35(DGND) U13.41(GND/Thermal_Pad) U17.5(GND)
AUDIO_CLK: U17.3(CLK) ; port AUDIO_CLK
AUDIO_DIN: U17.4(DOUT) ; port AUDIO_DIN
AUDIO_RST: R60.2 U13.32(~{RESET}) ; port AUDIO_RST
I2C1_SCL: U13.2(SCL) ; port I2C1_SCL
I2C1_SDA: U13.1(SDA) ; port I2C1_SDA
SAI1_FS: U13.40(LRCK) ; port SAI1_FS  [project net PE4]
SAI1_MCK: U13.37(MCLK) ; port SAI1_MCK  [project net PE2]
SAI1_SCK: U13.38(SCLK) ; port SAI1_SCK  [project net PE5]
SAI1_SD: U13.39(SDIN) ; port SAI1_SD  [project net PE6]
NetC53_1: C53.1 U13.28(AFILTB)
NetC56_2: C56.2 U13.10(-VHPFILT)
NetC57_1: C57.1 U13.12(FLYP)
NetC57_2: C57.2 U13.11(FLYN)
NetC59_1: C59.1 U13.27(AFILTA)
NetC60_1: C60.1 U13.19(VQ)
NetC63_1: C63.1 CN6.3 U13.14(HP/LINE_OUTB)
NetC63_2: C63.2 R69.1
NetC64_1: C64.1 CN6.2 U13.15(HP/LINE_OUTA)
NetC64_2: C64.2 R70.1
NetC66_1: C66.1 U13.18(FILT+)
NetCN6_1: CN6.1 R76.2
NetR75_1: R75.1 R77.2 U17.2(LR)

Not connected (* = marked no-connect by the designer): U13 4(SPKR_OUTA+)* 6(SPKR_OUTA-)* 7(SPKR_OUTB+)* 9(SPKR_OUTB-)* 20(TSTO)* 21(AIN4A)* 22(AIN4B)* 23(AIN3A)* 24(AIN3B)* 25(AIN2A)* 26(AIN2B)* 29(AIN1A)* 30(AIN1B)* 36(TSTO)*

### Notes on the sheet
- PB7
- PB6
- PE3
- PE2
- PE4
- PE5
- PE6
- (near U13) I2C address 0x94
- PE9
- PE7
- Title:
- Project:
- Size:
- Date:
- A4
- Reference:
- Sheet:
- Revision:
- of

### Library data of the parts
C50-C52 C58 C62 C65 C69 C70 = Cap_100nF_X7R_10%_0402: as C24 on sheet STM32Lx; Revision: July-2002: Re-released for DXP Platform.; Value: 100nF; Order: CC0402KRX7R7BB104; Manuf_1: YAGEO; ECCN_US/EU: n/a
C53 C59 = Cap_150pF_NPO_5%_0603: Capacitor,150pF,50V,NPO,5%,0603,YAGEO; Order: CC0603JRNPO9BN151; Revision: July-2002: Re-released for DXP Platform.; Value: 150pF; Manuf_1: YAGEO; Manuf_Part_1: CC0603JRNPO9BN151; ECCN_US/EU: n/a
C56 C57 C60 C66 = Cap_1uF_X5R_10%_0603: as C76 on sheet STM32Lx; Revision: July-2002: Re-released for DXP Platform.; Value: 1uF; Order: CC0603KRX5R7BB105; Manuf_1: YAGEO; ECCN_US/EU: n/a
C63 C64 = Cap_22nF_X7R_10%_0603: Capacitor,22nF,50V,X7R,10%,0603,YAGEO; Manuf_Part_1: CC0603KRX7R9BB223; Revision: July-2002: Re-released for DXP Platform.; Value: 22nF; Order: CC0603KRX7R9BB223; Manuf_1: YAGEO; ECCN_US/EU: n/a
C68 = Cap_1uF_POL_10%_TANA: as C23 on sheet STM32Lx; Revision: July-2002: Re-released for DXP Platform.; Value: 1uF; Manuf_1: AVX; Distrib: *; Order: TAJA105K016R; ECCN_US/EU: n/a
CN6 = ST-225-02: Connector Jack 3.5mm; Manuf_1: XIEJIA Electronics; Order: ST-225-02; Manuf_Part_1: ST-225-02; Distrib: Jiubaba; ECCN_US/EU: n/a
R60 = Res_10K_1%_0402: as R29 on sheet IDD_measurement; Value: 10K; Manuf_1: YAGEO; Order: RC0402FR-0710KL; ECCN_US/EU: n/a
R69 R70 = Res_51_1%_0402: Resistor,51,0402,1%,YAGEO; Manuf_Part_1: RC0402FR-0751RL; Value: 51; Order: 311-51.0LRTR-ND; Manuf_1: YAGEO; ECCN_US/EU: n/a; Distrib: DIGIKEY
R75 = Res_NA_0402: Resistor,[NA],0402; Fitted: NO; Value: [NA]; ECCN_US/EU: n/a
R76 R77 = Res_0_5%_0402: as R25 on sheet STM32Lx; ECCN_US/EU: n/a; Manuf_1: YAGEO; Distrib: FARNELL
U13 = CS43L22: Low Power, Stereo DAC w/Headphone & Speaker Amps; Manuf_1: Cirrus; Order: CS43L22-CNZ; ECCN_US/EU: EAR99/NEC; Manuf_Part_1: CS43L22-CNZ; Distrib: DIGIKEY
U17 = MP34DT01: MEMS audio sensor, omnidirectional digital microphone; Manuf_1: STM; Manuf_Part_1: MP34DT01TR; Provided: ST; Ref St: 9188008; ECCN_US/EU: EAR99/NEC; Order: MP34DT01TR; Distrib: ST

## Sheet MEMS.SchDoc: Gyroscope, Accelerometer, Magnetometer MEMS
size A4; Date: 01-DEC-2013; Author: A.B; CompanyName: STMicroelectronics; Organization: Microcontrollers Division; Address1: 12, Rue Jules HOROWITZ; Address2: 38019 Grenoble; Address3: FRANCE; DocumentNumber: MB1184; Revision: C-01; SheetNumber: 10; SheetTotal: 10; Project: STM32L476G-DISCO
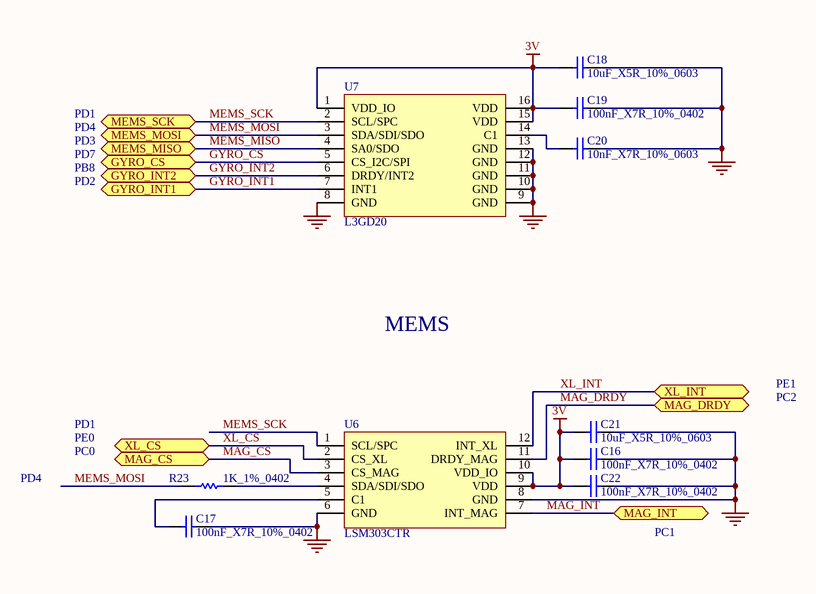
[diagram p4: MEMS.SchDoc]

### Parts
C16  100nF_X7R_10%_0402  [0402C]
C17  100nF_X7R_10%_0402  [0402C]
C18  10uF_X5R_10%_0603  [0603C]
C19  100nF_X7R_10%_0402  [0402C]
C20  10nF_X7R_10%_0603  [0603C]
C21  10uF_X5R_10%_0603  [0603C]
C22  100nF_X7R_10%_0402  [0402C]
R23  1K_1%_0402  [0402R]
U6  LSM303CTR  [LGA12_2x2]
U7  L3GD20  [LGA16-4x4]

### Ports
GYRO_CS, GYRO_INT1, GYRO_INT2, MAG_CS, MAG_DRDY, MAG_INT, MEMS_MISO, MEMS_MOSI, MEMS_SCK, XL_CS, XL_INT

### Nets
3V: C16.1 C18.1 C19.1 C21.1 C22.1 U6.9(VDD) U6.10(VDD_IO) U7.1(VDD_IO) U7.15(VDD) U7.16(VDD)
GND: C16.2 C17.2 C18.2 C19.2 C20.2 C21.2 C22.2 U6.6(GND) U6.8(GND) U7.8(GND) U7.9(GND) U7.10(GND) U7.11(GND) U7.12(GND) U7.13(GND)
GYRO_CS: U7.5(CS_I2C/SPI) ; port GYRO_CS
GYRO_INT1: U7.7(INT1) ; port GYRO_INT1
GYRO_INT2: U7.6(DRDY/INT2) ; port GYRO_INT2
MAG_CS: U6.3(CS_MAG) ; port MAG_CS
MAG_DRDY: U6.11(DRDY_MAG) ; port MAG_DRDY
MAG_INT: U6.7(INT_MAG) ; port MAG_INT
MEMS_MISO: U7.4(SA0/SDO) ; port MEMS_MISO
MEMS_MOSI: R23.1 U7.3(SDA/SDI/SDO) ; port MEMS_MOSI
MEMS_SCK: U6.1(SCL/SPC) U7.2(SCL/SPC) ; port MEMS_SCK
XL_CS: U6.2(CS_XL) ; port XL_CS  [project net PE0]
XL_INT: U6.12(INT_XL) ; port XL_INT  [project net PE1]
NetC17_1: C17.1 U6.5(C1)
NetC20_1: C20.1 U7.14(C1)
NetR23_2: R23.2 U6.4(SDA/SDI/SDO)

### Notes on the sheet
- PD7
- PD1
- PD3
- PD4
- PD2
- PB8
- MEMS
- PC2
- PE1
- PC0
- PE0
- PC1
- Title:
- Project:
- Size:
- Date:
- A4
- Reference:
- Sheet:
- Revision:
- of

### Library data of the parts
C16 C17 C19 C22 = Cap_100nF_X7R_10%_0402: as C24 on sheet STM32Lx; Revision: July-2002: Re-released for DXP Platform.; Value: 100nF; Order: CC0402KRX7R7BB104; Manuf_1: YAGEO; ECCN_US/EU: n/a
C18 C21 = Cap_10uF_X5R_10%_0603: Capacitor,10uF,6.3V,X5R,10%,0603,YAGEO; Manuf_Part_1: CC0603KRX5R5BB106; Revision: July-2002: Re-released for DXP Platform.; Value: 10uF; Order: CC0603KRX5R5BB106; Manuf_1: YAGEO; ECCN_US/EU: n/a
C20 = Cap_10nF_X7R_10%_0603: Capacitor,10nF,50V,X7R,10%,0603,YAGEO; Manuf_Part_1: CC0603KRX7R9BB103; Revision: July-2002: Re-released for DXP Platform.; Value: 10nF; Order: CC0603KRX7R9BB103; Manuf_1: YAGEO; ECCN_US/EU: n/a
R23 = Res_1K_1%_0402: Resistor,1K,0402,1%,YAGEO; Manuf_Part_1: RC0402FR-071KL; Value: 1K; Manuf_1: YAGEO; Order: RC0402FR-071KL; ECCN_US/EU: n/a
U6 = LSM303CTR: Ultra compact high performance e-compass 3D accelerometer and 3D magnetometer module; Manuf_1: STM; Provided: ST; Ref St: xxxxxxxx; ECCN_US/EU: EAR99/NEC; Manuf_Part_1: LSM303CTR; Distrib: ST; Footprint: LGA12(2*2); Order: LSM303CTR
U7 = L3GD20: MEMS motion sensor three-axis digital output gyroscope, WHO_AM_I REGISTER --> AP3GDL20BCA="11010101", L3GD20="11010100"; Manuf_1: STM; Manuf_Part_1: L3GD20TR; Manuf_Part_2: AP3GDL20BC4; Provided: ST; Ref St: 9177042; ECCN_US/EU: EAR99/NEC; Ref St_2: 9177052; Distrib: ST; Footprint: LGA16(4*4); Order: L3GD20TR; Manuf_2: STM

## Nets that join several sheets
3V: STM32Lx (R31.1 R32.1 R92.1 R93.1), IDD_measurement (R30.2), AUDIO (10 pins), MEMS (10 pins)
GND: STM32Lx (24 pins), IDD_measurement (26 pins), AUDIO (25 pins), MEMS (15 pins)
VDD_MCU: STM32Lx (15 pins), IDD_measurement (JP5.2 R27.2)
AUDIO_CLK: STM32Lx (U9.40), AUDIO (U17.3)
AUDIO_DIN: STM32Lx (U9.38), AUDIO (U17.4)
AUDIO_RST: STM32Lx (U9.2), AUDIO (R60.2 U13.32)
COM0: STM32Lx (U9.67), LCD_GH08172 (U5.16)
COM1: STM32Lx (SB24.1 U9.68), LCD_GH08172 (U5.15)
COM2: STM32Lx (SB25.1 U9.69), LCD_GH08172 (U5.14)
COM3: STM32Lx (U9.96), LCD_GH08172 (U5.13)
GYRO_CS: STM32Lx (U9.88), MEMS (U7.5)
GYRO_INT1: STM32Lx (U9.83), MEMS (U7.7)
GYRO_INT2: STM32Lx (U9.95), MEMS (U7.6)
I2C1_SCL: STM32Lx (R93.2 U9.92), AUDIO (U13.2)
I2C1_SDA: STM32Lx (R92.2 U9.93), AUDIO (U13.1)
MAG_CS: STM32Lx (U9.15), MEMS (U6.3)
MAG_DRDY: STM32Lx (U9.17), MEMS (U6.11)
MAG_INT: STM32Lx (U9.16), MEMS (U6.7)
MEMS_MISO: STM32Lx (U9.84), MEMS (U7.4)
MEMS_MOSI: STM32Lx (U9.85), MEMS (R23.1 U7.3)
MEMS_SCK: STM32Lx (U9.82), MEMS (U6.1 U7.2)
MFX_I2C_SCL: STM32Lx (R31.2 U9.47), IDD_measurement (U8.42)
MFX_I2C_SDA: STM32Lx (R32.2 U9.48), IDD_measurement (U8.43)
MFX_IRQ_OUT: STM32Lx (U9.7), IDD_measurement (U8.46)
MFX_WAKEUP: STM32Lx (U9.29), IDD_measurement (R34.2 U8.2)
NRST: STM32Lx (U9.14), IDD_measurement (D5.2)
PA6: STM32Lx (U9.31), LCD_GH08172 (U5.28)
PA7: STM32Lx (U9.32), LCD_GH08172 (U5.1)
PA15: STM32Lx (U9.77), LCD_GH08172 (U5.11)
PB0: STM32Lx (U9.35), LCD_GH08172 (U5.26)
PB1: STM32Lx (U9.36), LCD_GH08172 (U5.3)
PB4: STM32Lx (U9.90), LCD_GH08172 (U5.12)
PB5: STM32Lx (U9.91), LCD_GH08172 (U5.17)
PB12: STM32Lx (U9.51), LCD_GH08172 (U5.25)
PB13: STM32Lx (U9.52), LCD_GH08172 (U5.4)
PB14: STM32Lx (U9.53), LCD_GH08172 (U5.24)
PB15: STM32Lx (U9.54), LCD_GH08172 (U5.5)
PC4: STM32Lx (U9.33), LCD_GH08172 (U5.27)
PC5: STM32Lx (U9.34), LCD_GH08172 (U5.2)
PC6: STM32Lx (U9.63), LCD_GH08172 (U5.19)
PC7: STM32Lx (U9.64), LCD_GH08172 (U5.10)
PC8: STM32Lx (U9.65), LCD_GH08172 (U5.18)
PD8: STM32Lx (U9.55), LCD_GH08172 (U5.23)
PD9: STM32Lx (U9.56), LCD_GH08172 (U5.6)
PD10: STM32Lx (U9.57), LCD_GH08172 (U5.22)
PD11: STM32Lx (U9.58), LCD_GH08172 (U5.7)
PD12: STM32Lx (U9.59), LCD_GH08172 (U5.21)
PD13: STM32Lx (U9.60), LCD_GH08172 (U5.8)
PD14: STM32Lx (U9.61), LCD_GH08172 (U5.20)
PD15: STM32Lx (U9.62), LCD_GH08172 (U5.9)
PE0: STM32Lx (U9.97), MEMS (U6.2)
PE1: STM32Lx (U9.98), MEMS (U6.12)
PE2: STM32Lx (U9.1), AUDIO (U13.37)
PE4: STM32Lx (U9.3), AUDIO (U13.40)
PE5: STM32Lx (U9.4), AUDIO (U13.38)
PE6: STM32Lx (U9.5), AUDIO (U13.39)